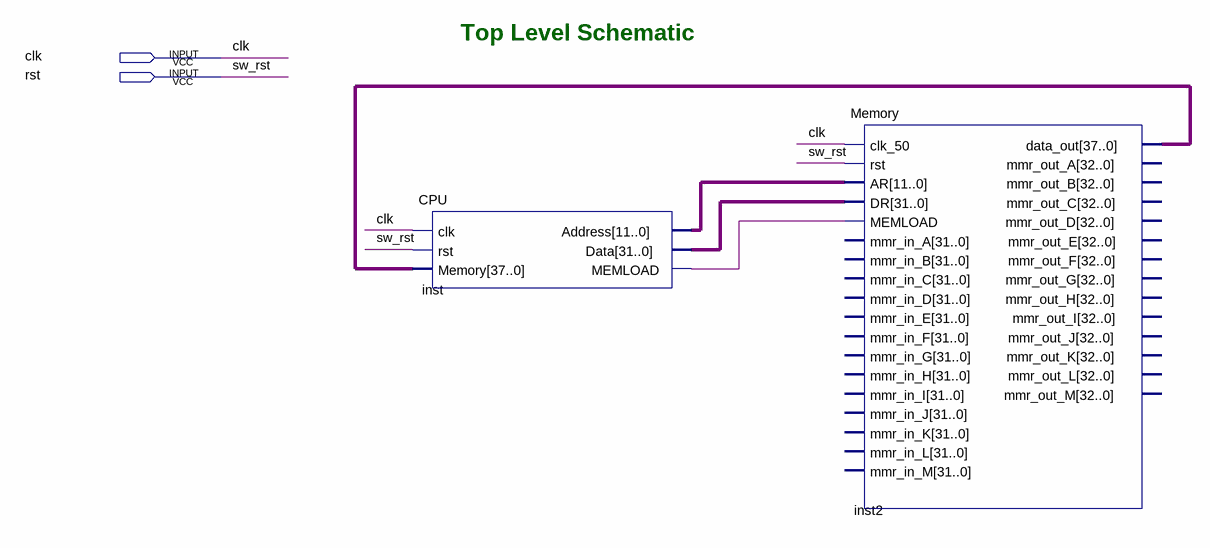
[diagram p0: schematic sheet]
// Quartus schematic TopLevel.bdf as structural Verilog: 2 symbols, 2 pins
module TopLevel (
  input  clk,
  input  rst
);

  wire inst_memload;
  wire [11:0] inst_address;
  wire [31:0] inst_data;
  wire [37:0] inst2_data_out;

  CPU inst (
    .clk(clk), .rst(rst), .Memory(inst2_data_out), .Address(inst_address), .Data(inst_data),
    .MEMLOAD(inst_memload));
  Memory inst2 (
    .clk_50(clk), .rst(rst), .AR(inst_address), .DR(inst_data), .MEMLOAD(inst_memload),
    .data_out(inst2_data_out));  // open: mmr_in_A, mmr_in_B, mmr_in_C, mmr_in_D, mmr_in_E, mmr_in_F, mmr_in_G, mmr_in_H, mmr_in_I, mmr_in_J, mmr_in_K, mmr_in_L, mmr_in_M, mmr_out_A, mmr_out_B, mmr_out_C, mmr_out_D, mmr_out_E, mmr_out_F, mmr_out_G, mmr_out_H, mmr_out_I, mmr_out_J, mmr_out_K, mmr_out_L, mmr_out_M

  // Other names for the same wires on the sheet: sw_rst = rst

  // Notes on the sheet:
  //   Top Level Schematic
endmodule
